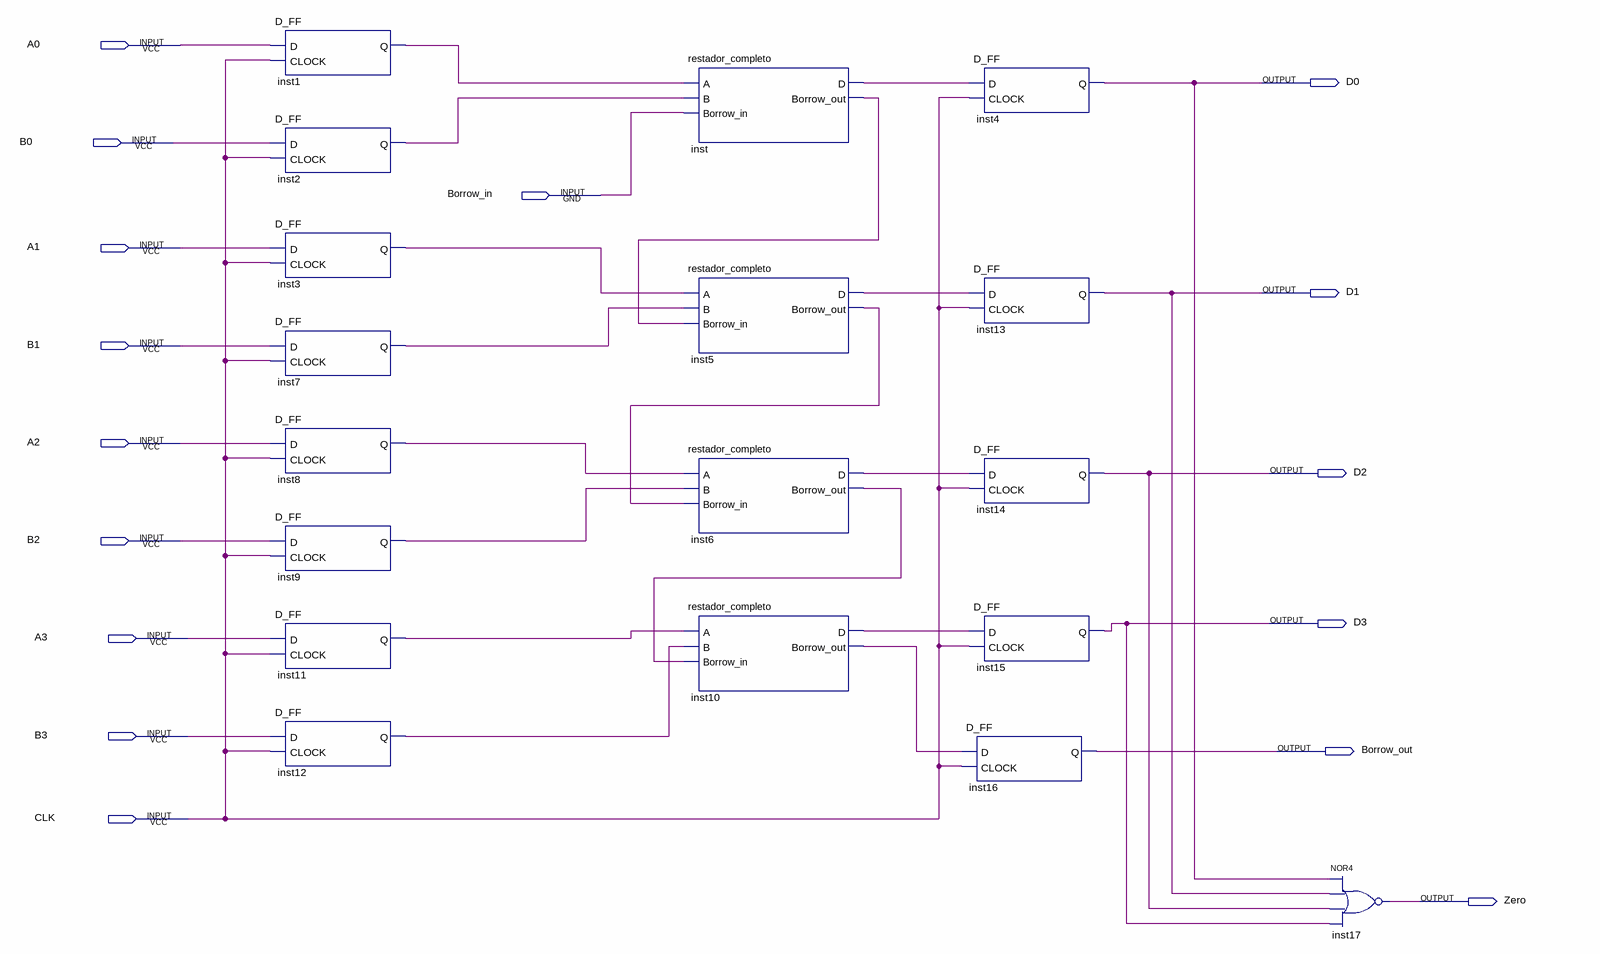
[diagram p0: schematic sheet]
// Quartus schematic restador_4_bits.bdf as structural Verilog: 18 symbols, 16 pins
module restador_4_bits (
  input  A0,
  input  B0,
  input  Borrow_in,
  input  A1,
  input  B1,
  input  A2,
  input  B2,
  input  A3,
  input  B3,
  input  CLK,
  output D0,
  output D1,
  output D2,
  output D3,
  output Borrow_out,
  output Zero
);

  wire inst1_q, inst2_q, inst3_q, inst5_borrow_out, inst5_d, inst6_borrow_out, inst6_d, inst7_q, inst8_q,
       inst9_q, inst10_borrow_out, inst10_d, inst11_q, inst12_q, inst_borrow_out, inst_d;

  D_FF inst1 (.D(A0), .CLOCK(CLK), .Q(inst1_q));
  D_FF inst2 (.D(B0), .CLOCK(CLK), .Q(inst2_q));
  D_FF inst3 (.D(A1), .CLOCK(CLK), .Q(inst3_q));
  D_FF inst7 (.D(B1), .CLOCK(CLK), .Q(inst7_q));
  D_FF inst8 (.D(A2), .CLOCK(CLK), .Q(inst8_q));
  D_FF inst9 (.D(B2), .CLOCK(CLK), .Q(inst9_q));
  D_FF inst11 (.D(A3), .CLOCK(CLK), .Q(inst11_q));
  D_FF inst12 (.D(B3), .CLOCK(CLK), .Q(inst12_q));
  restador_completo inst (.A(inst1_q), .B(inst2_q), .Borrow_in(Borrow_in), .D(inst_d), .Borrow_out(inst_borrow_out));
  restador_completo inst5 (
    .A(inst3_q), .B(inst7_q), .Borrow_in(inst_borrow_out), .D(inst5_d), .Borrow_out(inst5_borrow_out));
  restador_completo inst6 (
    .A(inst8_q), .B(inst9_q), .Borrow_in(inst5_borrow_out), .D(inst6_d), .Borrow_out(inst6_borrow_out));
  restador_completo inst10 (
    .A(inst11_q), .B(inst12_q), .Borrow_in(inst6_borrow_out), .D(inst10_d), .Borrow_out(inst10_borrow_out));
  D_FF inst16 (.D(inst10_borrow_out), .CLOCK(CLK), .Q(Borrow_out));
  D_FF inst4 (.D(inst_d), .CLOCK(CLK), .Q(D0));
  D_FF inst13 (.D(inst5_d), .CLOCK(CLK), .Q(D1));
  D_FF inst14 (.D(inst6_d), .CLOCK(CLK), .Q(D2));
  D_FF inst15 (.D(inst10_d), .CLOCK(CLK), .Q(D3));
  nor inst17 (Zero, D0, D1, D2, D3);
endmodule
